# EAGLE design implant 5.1 (EAGLE 7.7.0)
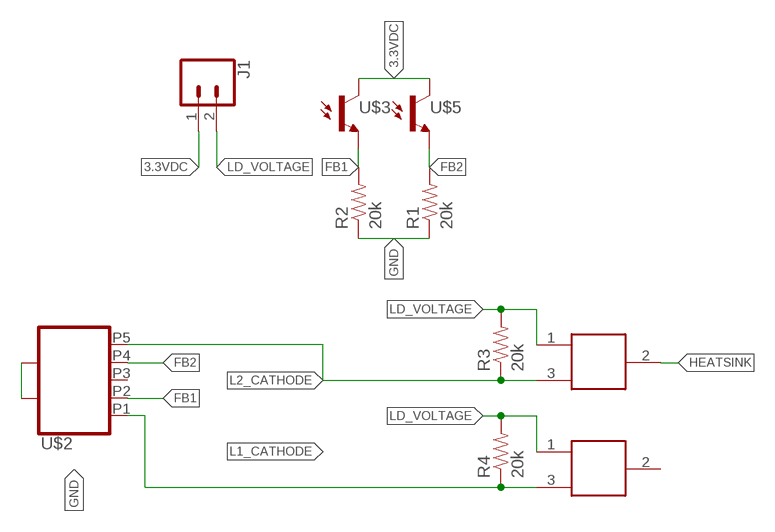
[diagram p0: schematic, sheet 1]

## Parts
J1  CONN_02  [1X02]
R1  20k  RESISTOR0805-RES  [0805]
R2  20k  RESISTOR0805-RES  [0805]
R3  20k  RESISTOR0805-RES  [0805]
R4  20k  RESISTOR0805-RES  [0805]
U$1  LASERDIODE3.8MM  [LASERDIODE_3.8]
U$2  USB_MICRO_SOCKET_VERT  [USB_VERT_MICRO_SMD]
U$3  AMBIENT-LIGHT-SENSOR  [PHOTO_PACK]
U$4  LASERDIODE3.8MM  [LASERDIODE_3.8]
U$5  AMBIENT-LIGHT-SENSOR  [PHOTO_PACK]

## Nets
3.3VDC: J1.1 U$3.COLLECTOR(C) U$5.COLLECTOR(C)
FB1: R2.2 U$2.P2 U$3.EMITTER(E)
FB2: R1.2 U$2.P4 U$5.EMITTER(E)
GND: R1.1 R2.1 U$2.P$1 U$2.P$2 U$2.P$3
HEATSINK: U$4.2
L1_CATHODE: R4.1 U$1.3 U$2.P1
L2_CATHODE: R3.1 U$2.P5 U$4.3
LD_VOLTAGE: J1.2 R3.2 R4.2 U$1.1 U$4.1
Unconnected: U$1.2 U$2.P3

## Library data of the parts
J1 = SparkFun-Connectors:CONN_02: Multi connection point. Often used as Generic Header-pin footprint for 0.1 inch spaced/style header connections On any of the 0.1 inch spaced packages, you can populate with these: Break Away Headers - Straight <https://www.sparkfun.com/products/116> (PRT-00116) Break Away Male Headers - Right Angle <https://www.sparkfun.com/products/553> (PRT-00553) Female Headers <https://www.sparkfun.com/products/115> (PRT-00115) Break Away Headers - Machine Pin <https://www.sparkfun.com/products/117> (PRT-00117) Break Away Female Headers - Swiss Machine Pin <https://www.sparkfun.com/products/743> (PRT-00743) For SCREWTERMINALS and SPRING TERMINALS visit here: Screw Terimnals on SparkFun.com <https://www.sparkfun.com/search/results?term=Screw+Terminals> (5mm/3.5mm/2.54mm spacing) This device is also useful as a general connection point to wire up your design to another part of your project. Our various solder wires solder well into these plated through hole pads. Hook-Up Wire - Assortment (Stranded, 22 AWG) <https://www.sparkfun.com/products/11375> (PRT-11375) Hook-Up Wire - Assortment (Solid Core, 22 AWG) <https://www.sparkfun.com/products/11367> (PRT-11367) View the entire wire category on our website here <https://www.sparkfun.com/categories/141> Special notes: Molex polarized connector foot print use with: PRT-08233 with associated crimp pins and housings. 2.54_SCREWTERM for use with PRT-10571. 3.5mm Screw Terminal footprints for PRT-08084 5mm Screw Terminal footprints for use with PRT-08432
R1-R4 = Andy-library:RESISTOR: Resistor Basic schematic elements and footprints for 0603, 1206, and PTH resistors.
U$1 U$4 = Cerebro-library:LASERDIODE
U$2 = Cerebro-library:USB_MICRO_SOCKET: horizontal socket. Digikey 609-4616-1-ND
U$3 U$5 = Cerebro-library:AMBIENT-LIGHT-SENSOR

## Board
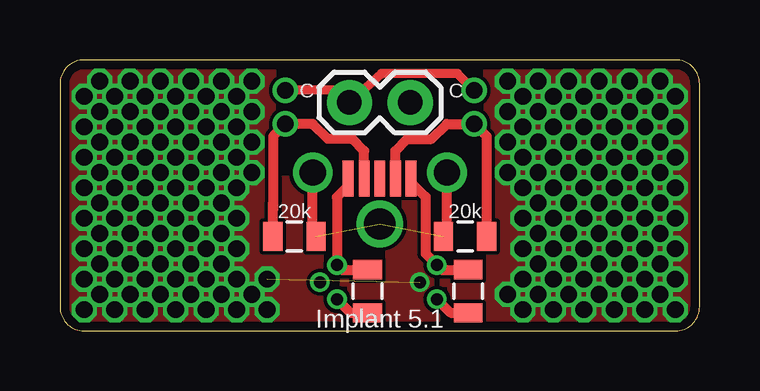
[diagram p1: board, top side]
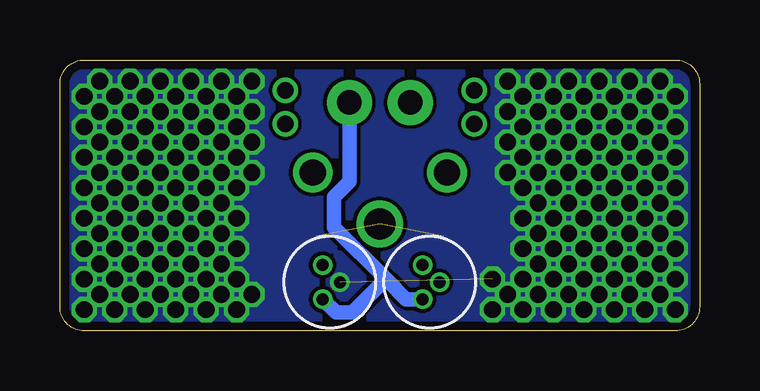
[diagram p2: board, bottom side, seen from below]

Size 26.67 x 11.3 mm. Coordinates in mm from the lower left corner, seen from the top.
Outline: 26.67,1 26.67,10.3 arc90 25.67,11.3 1,11.3 arc90 0,10.3 0,1 arc90 1,0 25.67,0 arc90 26.67,1
Copper layers (1*16): Top 0.035559375mm / dielectric 1.6mm / Bottom 0.035559375mm
Design rules "oshpark-2layer": minimum track width 6mil, minimum drill 10mil, track to track 6mil, track to pad 6mil, pad to pad 6mil, via to via 6mil, smd to smd 6mil, copper to edge 15mil, drill to drill 6mil, minimum pad ring 5mil, minimum via ring 5mil, stop-mask expansion 2.5mil, vias tented up to drill 0mil, thermal gap 10mil

### Footprints (pad centres in the part's own frame; a part is rotated, then mirrored left to right if it is on the bottom)
1X02 = drill 1.016 pad 1.88: 1 0,0; 2 2.54,0
0805 = smd 0.8 x 1.2: 1 -0.9,0; 2 0.9,0
LASERDIODE_3.8 = drill 0.5 pad 0.813: 1 -0.715,0.3; 2 0,-0.415; 3 0.715,0.3
USB_VERT_MICRO_SMD = smd 0.45 x 1.5: P1 -1.33,-0.25; P2 -0.65,-0.25; P3 0,-0.25; P4 0.65,-0.25; P5 1.3,-0.25 | drill 1.1: P$1 -2.8,0; P$2 2.8,0 | drill 1.3: P$3 0,-2.15
PHOTO_PACK = drill 0.7 pad 1.016: COLLECTOR 0,0; EMITTER 1.397,0

### Placement (x,y rotation side)
J1  12.06,9.53 0 top
R1  16.89,3.94 0 top
R2  9.78,3.94 180 top
R3  17.02,1.65 270 top
R4  12.83,1.65 270 top
U$1  11.25,2.03 90 bottom
U$2  13.34,6.6 0 top
U$3  9.4,10.03 270 top
U$4  15.42,2.03 90 bottom
U$5  17.27,10.03 270 top

### Tracks (layer width: path | path; a pad name or v marks a point on that pad's centre or on a via)
3.3VDC
  Top 0.381: U$3.COLLECTOR 11.43,10.03 J1.1 13.4,10.73 16.57,10.73 U$5.COLLECTOR
FB1
  Top 0.406: U$2.P2 12.69,7.51 12.19,8 11.18,8 10.54,8.64 U$3.EMITTER 8.89,8.12 8.89,5.08 | R2.2 8.89,5.08 | 8.89,5.08 8.89,5.34
FB2
  Top 0.406: U$2.P4 13.98,7.51 14.48,8 15.49,8 16.13,8.64 U$5.EMITTER 17.79,8.12 R1.2
GND  (2 unrouted)
  Top 0.406: R1.1 16.14,4.08 U$2.P$2 | R2.1 10.54,4.08 U$2.P$1
HEATSINK  (via drill 0.7)  (1 unrouted)
  other vias: 1.02,9.78 2.92,10.41 1.65,10.41 2.29,9.78 1.65,9.14 1.02,8.51 2.29,8.51 2.92,9.14 3.56,9.78 3.56,8.51 1.02,7.24 1.02,5.97 1.02,4.7 1.02,3.43 1.02,2.16 2.29,0.89 1.65,1.52 1.65,2.79 1.65,4.06 1.65,5.33 1.65,6.6 1.65,7.87 2.92,7.87 2.29,7.24 2.29,5.97 2.29,4.7 2.29,3.43 2.29,2.16 3.56,0.89 2.92,1.52 2.92,2.79 2.92,4.06 2.92,5.33 2.92,6.6 3.56,2.16 3.56,3.43 3.56,4.7 3.56,5.97 3.56,7.24 4.19,10.41 4.19,9.14 4.19,7.87 4.19,6.6 4.19,5.33 4.19,4.06 4.19,2.79 4.19,1.52 4.83,0.89 4.83,2.16 4.83,3.43 4.83,4.7 4.83,5.97 4.83,7.24 4.83,8.51 4.83,9.78 5.46,10.41 5.46,9.14 5.46,7.87 6.1,9.78 6.73,10.41 7.37,9.78 6.73,9.14 7.37,8.51 6.1,8.51 6.73,7.87 6.73,6.6 7.37,7.24 7.37,5.97 6.73,5.33 7.37,4.7 6.73,4.06 5.46,5.33 6.1,5.97 6.1,7.24 5.46,6.6 6.1,4.7 5.46,4.06 5.46,2.79 5.46,1.52 6.1,0.89 6.1,2.16 6.1,3.43 6.73,2.79 6.73,1.52 7.37,0.89 7.37,2.16 7.37,3.43 19.3,9.78 21.21,10.41 19.94,10.41 20.57,9.78 19.94,9.14 19.3,8.51 20.57,8.51 21.21,9.14 21.84,9.78 21.84,8.51 19.3,7.24 19.3,5.97 19.3,4.7 19.3,3.43 19.3,2.16 19.3,0.89 20.57,0.89 19.94,1.52 19.94,2.79 19.94,4.06 19.94,5.33 19.94,6.6 19.94,7.87 21.21,7.87 20.57,7.24 20.57,5.97 20.57,4.7 20.57,3.43 20.57,2.16 21.84,0.89 21.21,1.52 21.21,2.79 21.21,4.06 21.21,5.33 21.21,6.6 21.84,2.16 21.84,3.43 21.84,4.7 21.84,5.97 21.84,7.24 22.48,10.41 22.48,9.14 22.48,7.87 22.48,6.6 22.48,5.33 22.48,4.06 22.48,2.79 22.48,1.52 23.11,0.89 23.11,2.16 23.11,3.43 23.11,4.7 23.11,5.97 23.11,7.24 23.11,8.51 23.11,9.78 23.75,10.41 23.75,9.14 23.75,7.87 24.38,9.78 25.02,10.41 25.65,9.78 25.02,9.14 25.65,8.51 24.38,8.51 25.02,7.87 25.02,6.6 25.65,7.24 25.65,5.97 25.02,5.33 25.65,4.7 25.02,4.06 23.75,5.33 24.38,5.97 24.38,7.24 23.75,6.6 24.38,4.7 23.75,4.06 23.75,2.79 23.75,1.52 24.38,0.89 24.38,2.16 24.38,3.43 25.02,2.79 25.02,1.52 25.65,2.16 25.65,3.43 1.02,0.89 25.65,0.89 8.64,2.16 8,1.52 8.64,0.89 18.67,1.52 8,6.6 8,7.87 18.67,6.6 18.67,7.87 8,9.14 8,10.41 18.67,9.14 18.67,10.41
  pour Bottom: -3.17,15.24 32.38,15.24 32.38,-4.45 -3.17,-4.45
  pour Top: -1.91,14.61 30.48,14.61 30.48,-3.17 -1.91,-3.17
L1_CATHODE
  Top 0.406: U$2.P1 12.01,6.04 11.54,5.57 11.55,5.56 U$1.3 11.75,2.55 R4.1
L2_CATHODE
  Top 0.406: U$2.P5 14.63,6.19 15.24,5.59 15.24,3.23 U$4.3 15.91,2.55 R3.1
LD_VOLTAGE
  Top 0.406: U$1.1 12.12,0.75 R4.2 | U$4.1 16.28,0.75 R3.2
  Bottom 0.61: J1.2 14.61,6.22 15.24,5.59 15.24,4.32 13.02,2.1 | 13.02,2.1 12.24,1.32 U$1.1 | U$4.1 15.16,0.76 14.48,0.76 13.14,2.1 13.02,2.1

### Text on the board
tNames: C | C | Implant 5.1